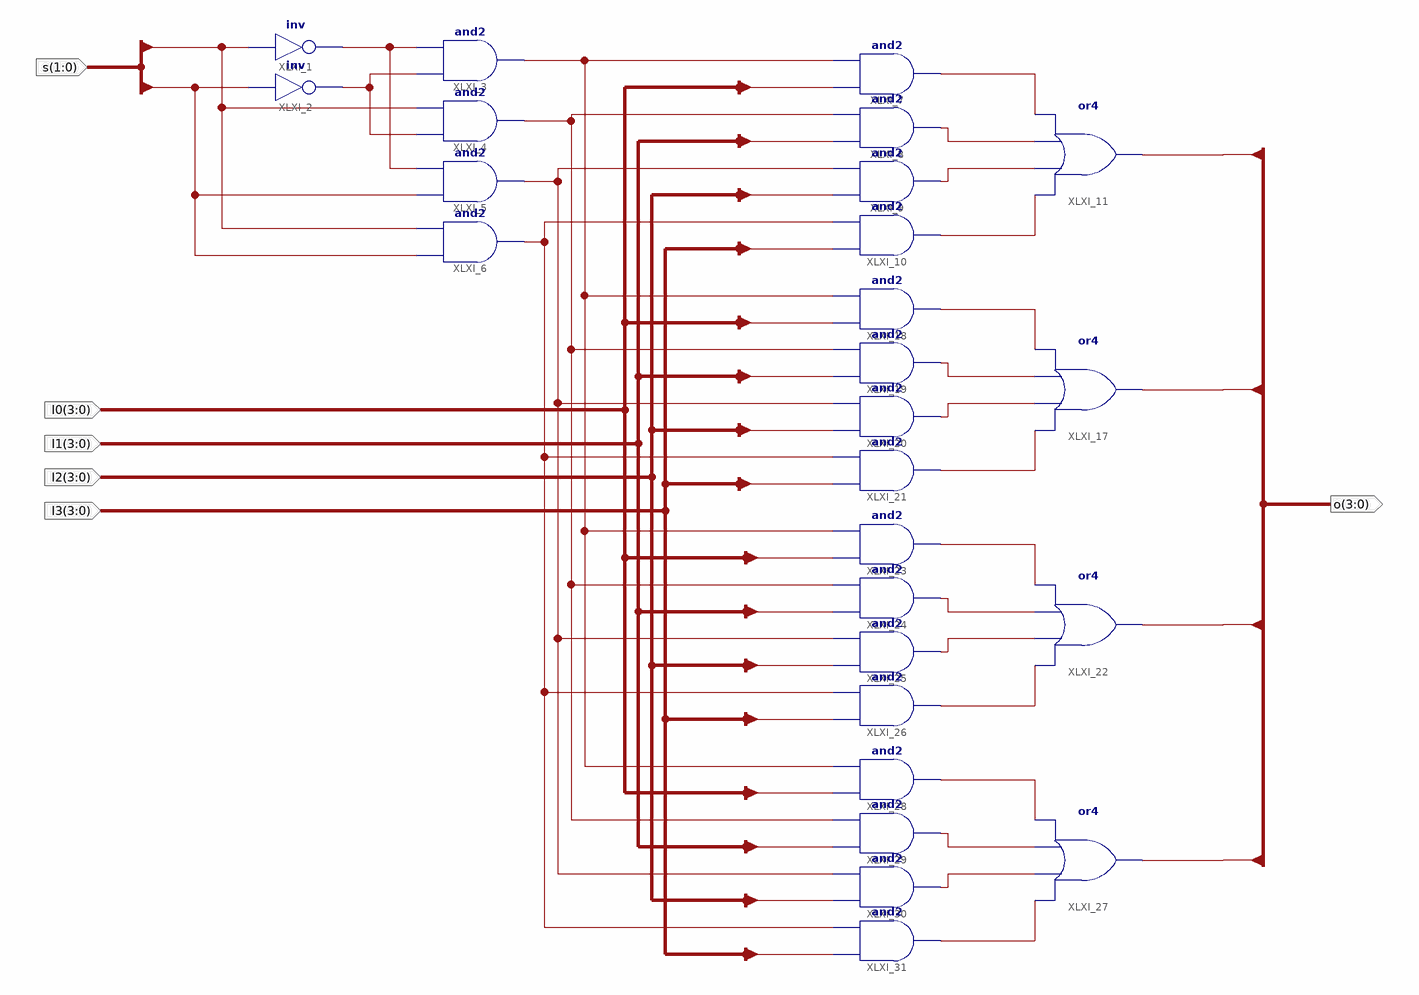
[diagram p0: schematic sheet 1]
// Xilinx ISE schematic MUX4T1_4.sch (spartan3) as structural Verilog: 26 symbols, 6 ports
module MUX4T1_4 (
  input  [1:0] s,
  input  [3:0] I0,
  input  [3:0] I1,
  input  [3:0] I3,
  input  [3:0] I2,
  output [3:0] o
);

  wire XLXN_6, XLXN_7, XLXN_9, XLXN_10, XLXN_11, XLXN_12, XLXN_22, XLXN_23, XLXN_24, XLXN_26, XLXN_27,
       XLXN_28, XLXN_29, XLXN_31, XLXN_32, XLXN_33, XLXN_34, XLXN_36, XLXN_40, XLXN_56, XLXN_57, XLXN_58;

  or XLXI_11 (o[0], XLXN_12, XLXN_11, XLXN_10, XLXN_9);
  and XLXI_7 (XLXN_9, I0[0], XLXN_40);
  and XLXI_8 (XLXN_10, I1[0], XLXN_56);
  and XLXI_9 (XLXN_11, I2[0], XLXN_57);
  and XLXI_10 (XLXN_12, I3[0], XLXN_58);
  or XLXI_17 (o[1], XLXN_24, XLXN_26, XLXN_23, XLXN_22);
  and XLXI_18 (XLXN_22, I0[1], XLXN_40);
  and XLXI_19 (XLXN_23, I1[1], XLXN_56);
  and XLXI_20 (XLXN_26, I2[1], XLXN_57);
  and XLXI_21 (XLXN_24, I3[1], XLXN_58);
  or XLXI_22 (o[2], XLXN_29, XLXN_31, XLXN_28, XLXN_27);
  and XLXI_23 (XLXN_27, I0[2], XLXN_40);
  and XLXI_24 (XLXN_28, I1[2], XLXN_56);
  and XLXI_25 (XLXN_31, I2[2], XLXN_57);
  and XLXI_26 (XLXN_29, I3[2], XLXN_58);
  or XLXI_27 (o[3], XLXN_34, XLXN_36, XLXN_33, XLXN_32);
  and XLXI_28 (XLXN_32, I0[3], XLXN_40);
  and XLXI_29 (XLXN_33, I1[3], XLXN_56);
  and XLXI_30 (XLXN_36, I2[3], XLXN_57);
  and XLXI_31 (XLXN_34, I3[3], XLXN_58);
  not XLXI_1 (XLXN_6, s[0]);
  not XLXI_2 (XLXN_7, s[1]);
  and XLXI_3 (XLXN_40, XLXN_7, XLXN_6);
  and XLXI_4 (XLXN_56, XLXN_7, s[0]);
  and XLXI_5 (XLXN_57, s[1], XLXN_6);
  and XLXI_6 (XLXN_58, s[1], s[0]);
endmodule
